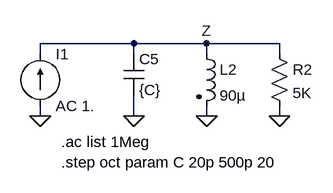
[diagram p0: schematic builtin_09_ACstep.asc]
builtin_09_ACstep.asc, the LTspice schematic file:
Version 4
SHEET 1 2536 1712
WIRE 1168 1120 1024 1120
WIRE 1280 1120 1168 1120
WIRE 1392 1120 1280 1120
WIRE 1024 1136 1024 1120
WIRE 1168 1136 1168 1120
WIRE 1280 1136 1280 1120
WIRE 1392 1136 1392 1120
WIRE 1024 1232 1024 1216
WIRE 1168 1232 1168 1200
WIRE 1280 1232 1280 1216
WIRE 1392 1232 1392 1216
FLAG 1280 1120 Z
FLAG 1024 1232 0
FLAG 1168 1232 0
FLAG 1280 1232 0
FLAG 1392 1232 0
SYMBOL CURRENT 1024 1216 M180
WINDOW 0 24 80 Left 2
WINDOW 3 24 0 Left 2
SYMATTR InstName I1
SYMATTR Value AC 1.
SYMBOL CAP 1152 1136 R0
SYMATTR InstName C5
SYMATTR Value {C}
SYMBOL IND2 1264 1120 R0
SYMATTR InstName L2
SYMATTR Value 90µ
SYMBOL RES 1376 1120 R0
SYMATTR InstName R2
SYMATTR Value 5K
TEXT 1056 1272 Left 2 !.ac list 1Meg\n.step oct param C 20p 500p 20

The netlist it stands for:
* builtin_09_ACstep.asc
I1 0 Z AC 1.
C5 Z 0 {C}
L2 Z 0 90µ
R2 Z 0 5K
.ac list 1Meg
.step oct param C 20p 500p 20
.backanno
.end